# Altium schematic sheet 4_SDCard.SchDoc: Apalis Evaluation Board 1.1
size A3; Organization: Toradex AG; Address1: Altsagenstrasse 5; Address2: Horw; Address3: 6048; Address4: Switzerland; DocumentNumber: 8; Revision: V1.1; SheetNumber: 8; SheetTotal: 32; PageSetup: Record=PageOptions|CenterHorizontal=True|CenterVertical=True|PrintScale=0.73|XCorrection=1.00|YCorrection=1.00|PrintKind=0|BorderSize=5000000|LeftOffset=0|BottomOffset=0|Orientation=2|PaperLength=1000|PaperWidth=1000|Scale=100|PaperSource=7|PrintQuality=-4|MediaType=1|DitherType=10|PaperKind=A4|PrintScaleMode=1
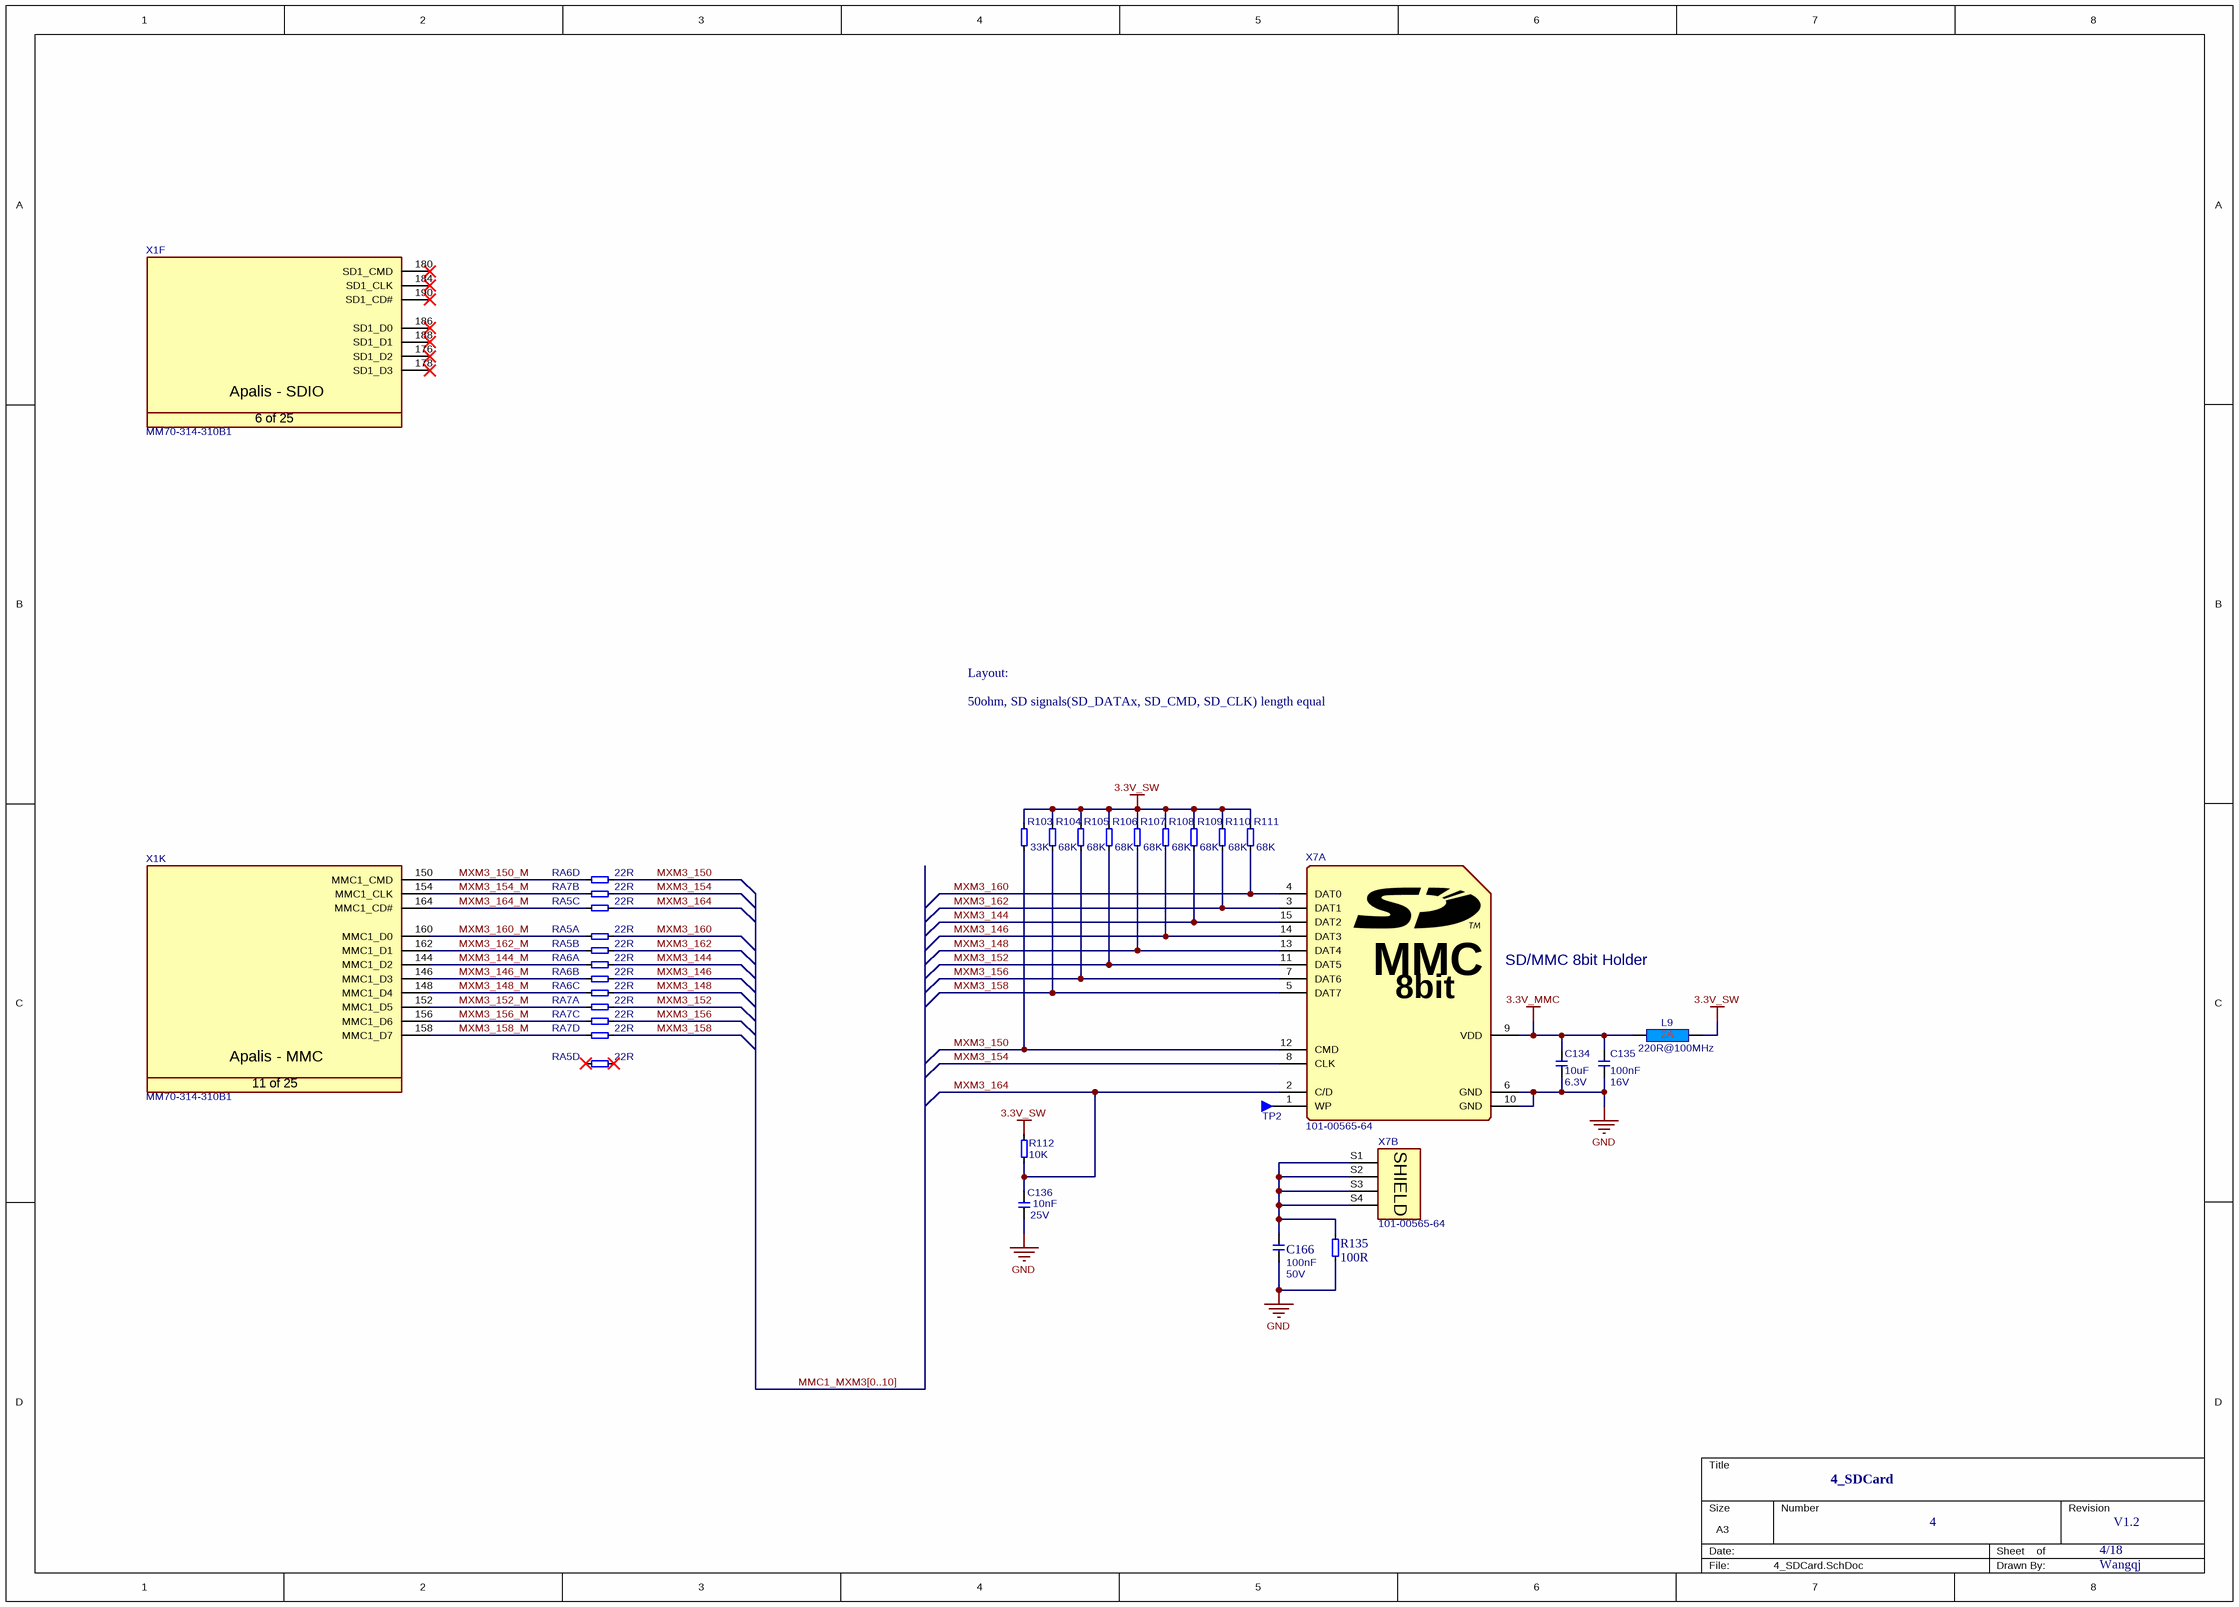
[diagram p0: 4_SDCard.SchDoc]

## Parts
C134  Rating: 6.3V  [T_CAPC0603X33N]  (hidden comment: 10uF)
C135  Rating: 16V  [T_CAPC0603X33N]  (hidden comment: 100nF)
C136  Rating: 25V  [T_CAPC0603X33N]  (hidden comment: 10nF)
C166  Rating: 50V  [T_CAPC0603X33N]  (hidden comment: 100nF)
L9  220R@100MHz  [INDC1608X95N]
R103  33K  [T_RESC0603X30N]
R104  68K  [T_RESC0603X30N]
R105  68K  [T_RESC0603X30N]
R106  68K  [T_RESC0603X30N]
R107  68K  [T_RESC0603X30N]
R108  68K  [T_RESC0603X30N]
R109  68K  [T_RESC0603X30N]
R110  68K  [T_RESC0603X30N]
R111  68K  [T_RESC0603X30N]
R112  10K  [T_RESC0603X30N]
R135  100R  [T_RESC0603X30N]
RA5  22R  [T_Resistor_Array_X4]  (parts A,B,C,D of 4)
RA6  22R  [T_Resistor_Array_X4]  (parts A,B,C,D of 4)
RA7  22R  [T_Resistor_Array_X4]  (parts A,B,C,D of 4)
TP2  Testpin  [T_TP-THT]  (value not drawn)
X1  Manufacturer Part No.: MM70-314-310B1  [T_JAE_MM70-314-310B1]  (hidden comment: CON-JAE-MM70-314-310B1-314-0.5mm)  (parts F,K of 25)
X7  101-00565-64  [T_ AMPHENOL_101-00565]  (parts A,B of 2)

## Nets
3.3V_MMC: C134.2 C135.2 L9.1 X7.9(VDD)
3.3V_SW: L9.2 R103.2 R104.2 R105.2 R106.2 R107.2 R108.2 R109.2 R110.2 R111.2 R112.2
GND: C134.1 C135.1 C136.1 C166.1 R135.1 X7.6(GND) X7.10(GND)
MXM3_144: R109.1 RA6.5 X7.15(DAT2)
MXM3_144_M: RA6.1 X1.144(MMC1_D2)
MXM3_146: R108.1 RA6.6 X7.14(DAT3)
MXM3_146_M: RA6.2 X1.146(MMC1_D3)
MXM3_148: R107.1 RA6.7 X7.13(DAT4)
MXM3_148_M: RA6.3 X1.148(MMC1_D4)
MXM3_150: R103.1 RA6.8 X7.12(CMD)
MXM3_150_M: RA6.4 X1.150(MMC1_CMD)
MXM3_152: R106.1 RA7.5 X7.11(DAT5)
MXM3_152_M: RA7.1 X1.152(MMC1_D5)
MXM3_154: RA7.6 X7.8(CLK)
MXM3_154_M: RA7.2 X1.154(MMC1_CLK)
MXM3_156: R105.1 RA7.7 X7.7(DAT6)
MXM3_156_M: RA7.3 X1.156(MMC1_D6)
MXM3_158: R104.1 RA7.8 X7.5(DAT7)
MXM3_158_M: RA7.4 X1.158(MMC1_D7)
MXM3_160: R111.1 RA5.5 X7.4(DAT0)
MXM3_160_M: RA5.1 X1.160(MMC1_D0)
MXM3_162: R110.1 RA5.6 X7.3(DAT1)
MXM3_162_M: RA5.2 X1.162(MMC1_D1)
MXM3_164: C136.2 R112.1 RA5.7 X7.2(C/D)
MXM3_164_M: RA5.3 X1.164(MMC1_CD#)
NetC166_2: C166.2 R135.2 X7.S1(S) X7.S2(S) X7.S3(S) X7.S4(S)
NetTP2_1: TP2.1 X7.1(WP)

Not connected (* = marked no-connect by the designer): RA5 4* 8*; X1 176(SD1_D2)* 178(SD1_D3)* 180(SD1_CMD)* 184(SD1_CLK)* 186(SD1_D0)* 188(SD1_D1)* 190(SD1_CD#)*

## Buses and harness runs
bus MMC1_MXM3[0..10]

## Notes on the sheet
- Layout:
- 50ohm, SD signals(SD_DATAx, SD_CMD, SD_CLK) length equal
- (near X7) SD/MMC 8bit Holder
- 4_SDCard
- 4
- 4/18
- V1.2
- Wangqj
- Title
- Size:
- Date:
- A3
- Number:
- Time:
- Revision:
- Sheet
- of
- File:
- (in symbol CON-Amphenol-101-00565-64, part A) MMC; 8bit
- (in symbol CON-Amphenol-101-00565-64, part B) SHIELD
- (in symbol CON-JAE-MM70-314-310B1-314-0.5mm, part F) Apalis - SDIO; 6 of 25
- (in symbol CON-JAE-MM70-314-310B1-314-0.5mm, part K) Apalis - MMC; 11 of 25

## Library data of the parts
C134 = C-X5R-10uF-6.3V-20%-0603: Capacitor Ceramic X5R 10uF 6.3V 20% 0603; Tolerance: 20%; Type: X5R; Value: 10uF
C135 = C-X7R-100nF-16V-10%-0603: Capacitor Ceramic X7R 100nF 16V 10% 0603; Tolerance: 10%; Type: X7R; Value: 100nF
C136 = C-X7R-10nF-25V-10%-0603: Capacitor Ceramic X7R 10nF 25V 10% 0603; Tolerance: 10%; Type: X7R; Value: 10nF
C166 = C-100nF-50V-20%-0603-X7R: Capacitor Ceramic X7R 100nF 50V 20% 0603; Tolerance: 20%; Type: X7R; Value: 100nF
L9 = L-220R@100MHz-2A-25%-0603: 220R@100MHz 2A EMI FILTER; Tolerance: 25%; Rating: 2A; Value: 220R@100MHz
R103 = R-33KR-63mW-5%-0603: Resistor 33 Kohm 63mW 5% 0603; Value: 33KR; Rating: 63mW; Tolerance: 5%
R104-R111 = R-68KR-63mW-5%-0603: Resistor 68 Kohm 63mW 5% 0603; Value: 68KR; Rating: 63mW; Tolerance: 5%
R112 = R-10KR-63mW-5%-0603: Resistor 10 Kohm 63mW 5% 0603; Value: 10KR; Rating: 63mW; Tolerance: 5%
R135 = R-120R-63mW-5%-0603: Resistor 120 ohm 63mW 5% 0603; Rating: 63mW; Tolerance: 5%; Value: 100R
RA5-RA7 = RA-22R-63mW-5%-1206-div: Resistor Array 22 R 63mW 5% 1206; Tolerance: 5%; Power Dissipation: 63mW; Value: 22R
TP2 = Testpin: Testpin TH
X1 = CON-JAE-MM70-314-310B1-314-0.5mm: MXM3 Connector; Manufacturer Name: JAE; No. of ways: 314
X7 = CON-Amphenol-101-00565-64: SD/MMC 8bit Card Holder; No. of ways: 13+2; Manufacturer Name: Amphenol; Manufacturer Part No.: 101-00565-64